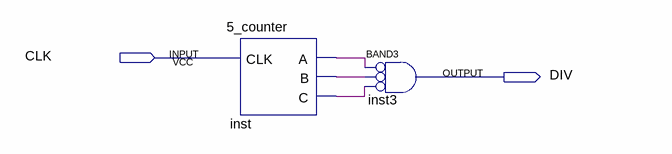
[diagram p0: schematic sheet]
// Quartus schematic 5_div.bdf as structural Verilog: 2 symbols, 2 pins
module \5_div  (
  input  CLK,
  output DIV
);

  wire inst_a, inst_b, inst_c;

  \5_counter  inst (.CLK(CLK), .A(inst_a), .B(inst_b), .C(inst_c));
  and inst3 (DIV, ~inst_a, ~inst_b, ~inst_c);  // BAND3
endmodule
